# EAGLE design Ai_Breakout_OLED-0.96 (EAGLE 6.5.0)
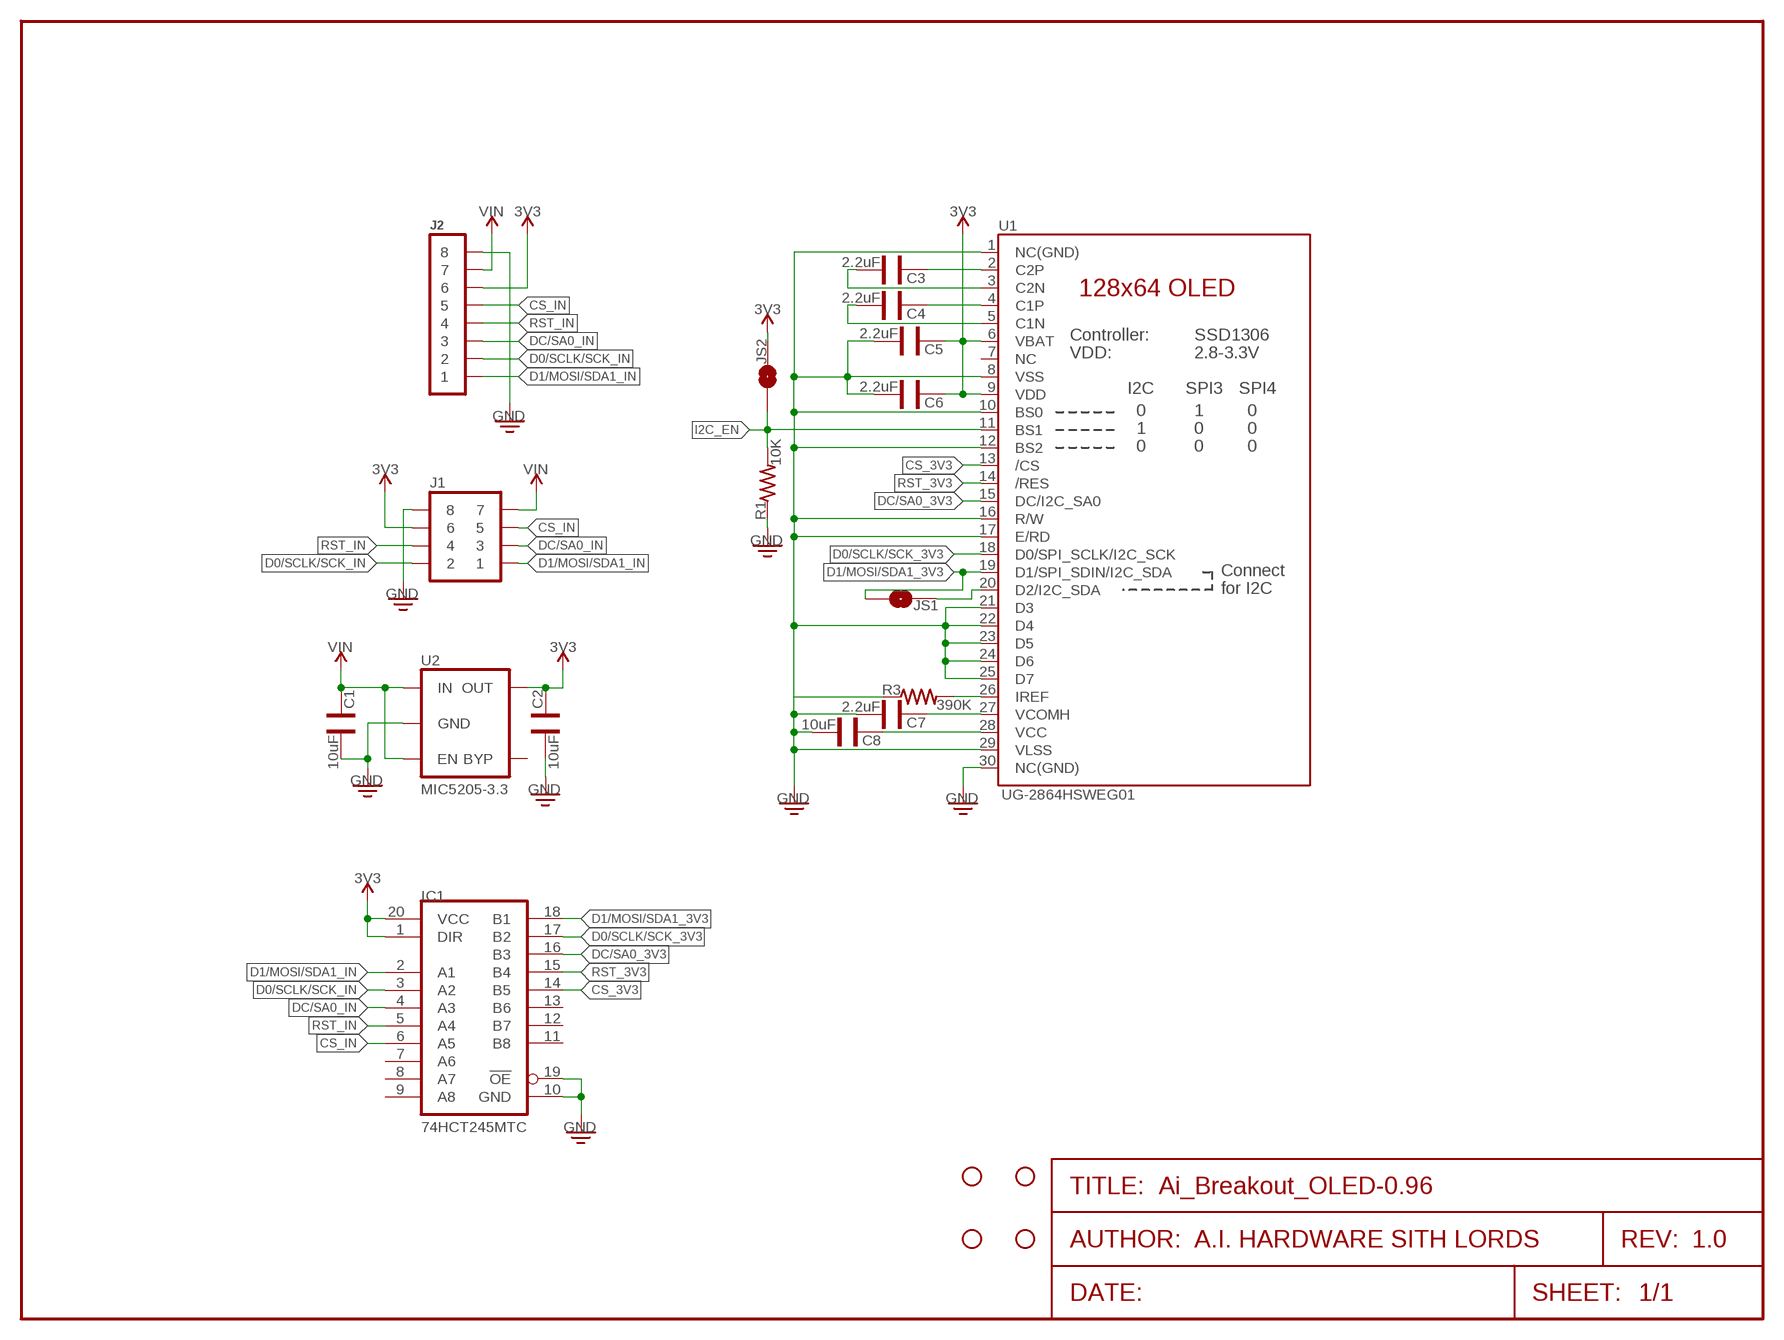
[diagram p0: schematic, sheet 1]
FRAME1 (FRAME-LETTER): AUTHOR: A.I. HARDWARE SITH LORDS; REV: 1.0

## Parts
C1  10uF  CAP0603  [CAP-0603]
C2  10uF  CAP0603  [CAP-0603]
C3  2.2uF  CAP0603  [CAP-0603]
C4  2.2uF  CAP0603  [CAP-0603]
C5  2.2uF  CAP0603  [CAP-0603]
C6  2.2uF  CAP0603  [CAP-0603]
C7  2.2uF  CAP0603  [CAP-0603]
C8  10uF  CAP0603  [CAP-0603]
IC1  74HCT245MTC  [SSOP20]
J1  2X04  [2X04]
J2  1X08  [1X08]
JS1  1X02-SJ-NO  [1X02-SJ-NO]
JS2  1X02-SJ-NO  [1X02-SJ-NO]
M1  STAND-OFF  [STAND-OFF]
M2  STAND-OFF  [STAND-OFF]
M3  STAND-OFF  [STAND-OFF]
M4  STAND-OFF  [STAND-OFF]
R1  10K  RES0603  [RES-0603]
R3  390K  RES0603  [RES-0603]
U1  UG-2864HSWEG01  UG-2864HSWEG01-0.96  [UG-2864HSWEG01_0.96_WRAP]
U2  MIC5205-3.3  [SOT23-5]

## Nets
3V3: C2.2 C5.2 C6.2 IC1.1(DIR) IC1.20(VCC) J1.6 J2.6 JS2.2 U1.6(VBAT) U1.9(VDD) U2.5(OUT)
CS_3V3: IC1.14(B5) U1.13(/CS)
CS_IN: IC1.6(A5) J1.5 J2.5
D0/SCLK/SCK_3V3: IC1.17(B2) U1.18(D0/SPI_SCLK/I2C_SCK)
D0/SCLK/SCK_IN: IC1.3(A2) J1.2 J2.2
D1/MOSI/SDA1_3V3: IC1.18(B1) JS1.1 U1.19(D1/SPI_SDIN/I2C_SDA)
D1/MOSI/SDA1_IN: IC1.2(A1) J1.1 J2.1
DC/SA0_3V3: IC1.16(B3) U1.15(DC/I2C_SA0)
DC/SA0_IN: IC1.4(A3) J1.3 J2.3
GND: C1.1 C2.1 C5.1 C6.1 C7.1 C8.1 IC1.10(GND) IC1.19(!OE) J1.8 J2.8 R1.1 R3.1 U1.1(NC(GND)) U1.8(VSS) U1.10(BS0) U1.12(BS2) U1.16(R/W) U1.17(E/RD) U1.21(D3) U1.22(D4) U1.23(D5) U1.24(D6) U1.25(D7) U1.29(VLSS) U1.30(NC(GND)) U2.2(GND)
I2C_EN: JS2.1 R1.2 U1.11(BS1)
N$3: R3.2 U1.26(IREF)
N$4: C3.2 U1.2(C2P)
N$5: C3.1 U1.3(C2N)
N$6: C4.2 U1.4(C1P)
N$7: C4.1 U1.5(C1N)
N$8: JS1.2 U1.20(D2/I2C_SDA)
N$11: C8.2 U1.28(VCC)
N$12: C7.2 U1.27(VCOMH)
RST_3V3: IC1.15(B4) U1.14(/RES)
RST_IN: IC1.5(A4) J1.4 J2.4
VIN: C1.2 J1.7 J2.7 U2.1(IN) U2.3(EN)
Unconnected: IC1.7(A6) IC1.8(A7) IC1.9(A8) IC1.11(B8) IC1.12(B7) IC1.13(B6) U1.7(NC) U2.4(BYP)

## Library data of the parts
C1-C8 = Ai_Passives:CAP
IC1 = Ai_IC:74HCT245: Octal BUS TRANSCEIVER, 3-state
J1 = Ai_Connectors:2X04
J2 = Ai_Connectors:1X08
JS1 JS2 = Ai_Connectors:1X02-SJ-NO: Solder Jumper SMD solder jumper: Normally Open and Normally Closed are the same, but have different paste layers. NC will have a large amount of paste and should jumper during reflow.
M1-M4 = Ai_Electromechanical:STAND-OFF: #4 Stand Off This is the mechanical footprint for a #4 phillips button head screw. Use the keepout ring to avoid running the screw head into surrounding components.
R1 R3 = Ai_Passives:RES: Part # blah Digikey
U1 = Ai_Displays:UG-2864HSWEG01: UG-2864HSWEG01 OLED display Both 1.3" and 0.96" models share the same FPC tab footprint, only the screen dimensions vary.
U2 = Ai_Power:MIC5205-*: Fixed-Voltage Regulator Standard voltage regulator in SOT23-5 layout. Micrel part MIC5205x.x where x.x designates the output voltage (e.g., 3.3). BYP pin is used to lower output noise with 470pF cap. Haven't tested the footprint on an actual board yet!

## Board
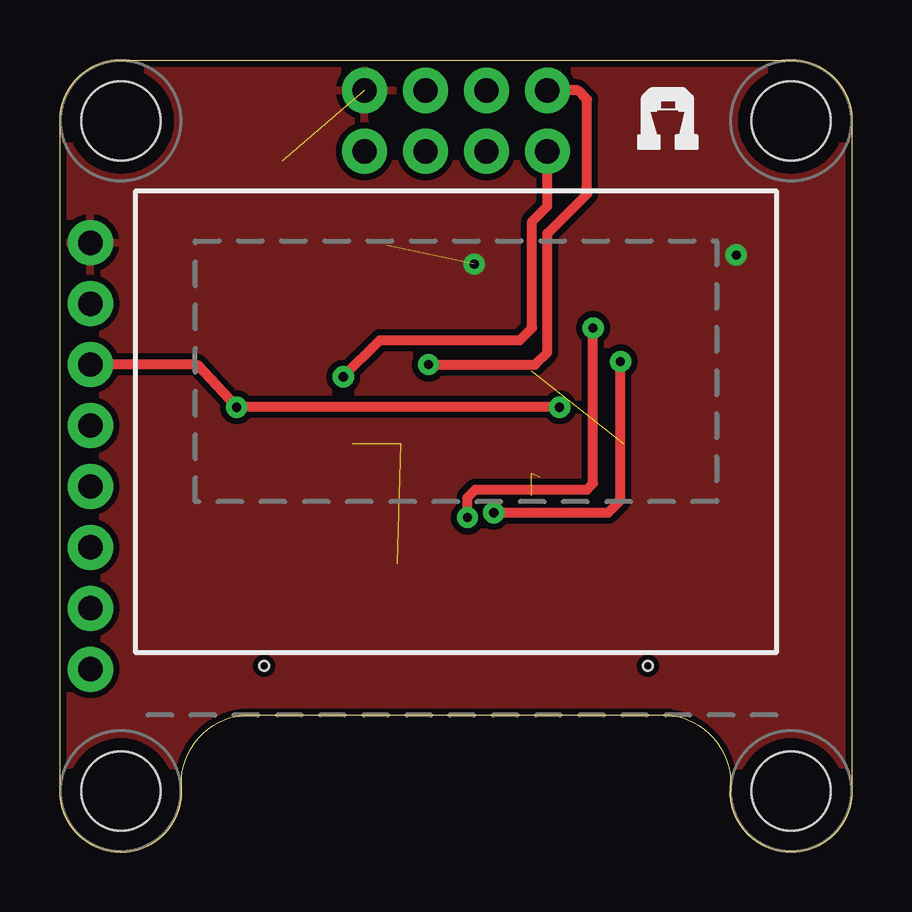
[diagram p1: board, top side]
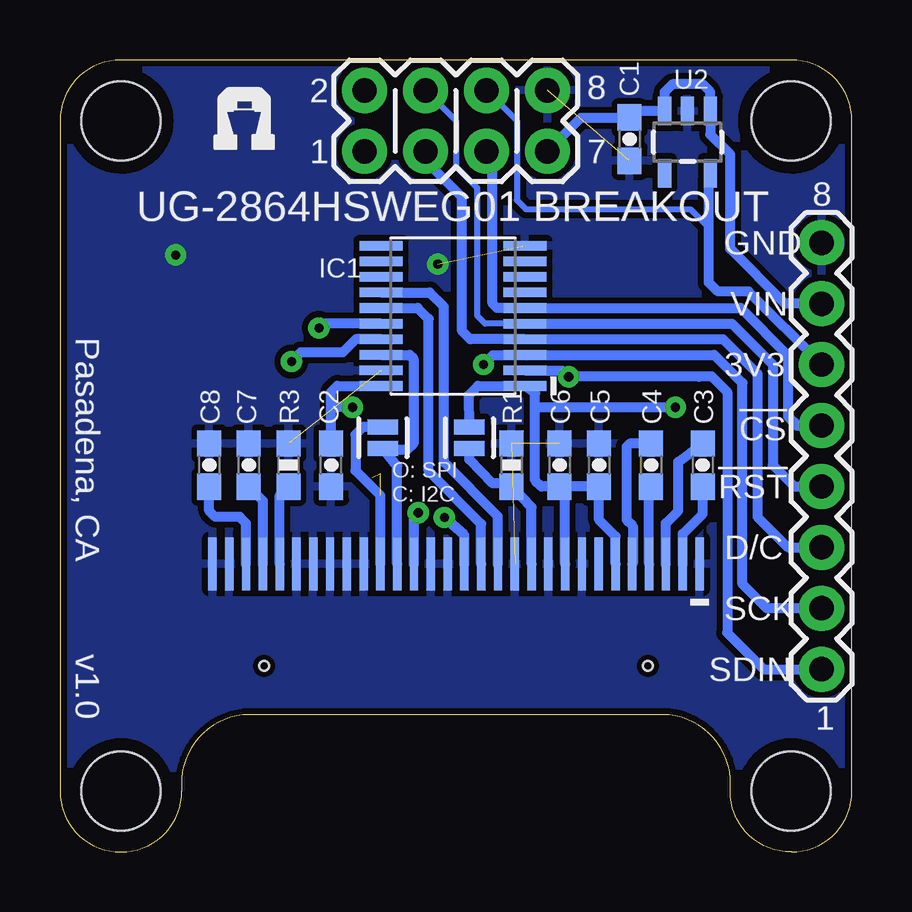
[diagram p2: board, bottom side, seen from below]

Size 33.02 x 33.02 mm. Coordinates in mm from the lower left corner, seen from the top.
Outline: 0,2.54 0,30.48 arc-90 2.54,33.02 30.48,33.02 arc-90 33.02,30.48 33.02,2.54 arc-90 30.48,0 arc-90 27.94,2.54 arc90 25.4,5.71 7.62,5.71 arc90 5.08,2.54 arc-90 2.54,0 arc-90 0,2.54
Copper layers (1*16): Top 0.035mm / dielectric 1.5mm / Bottom 0.035mm
Design rules "ai_2layer": minimum track width 7mil, minimum drill 15mil, track to track 8mil, track to pad 8mil, pad to pad 8mil, via to via 8mil, smd to smd 8mil, copper to edge 8mil, drill to drill 8mil, minimum pad ring 12mil, minimum via ring 10mil, stop-mask expansion 4mil, vias tented up to drill 20mil, thermal gap 10mil

### Footprints (pad centres in the part's own frame; a part is rotated, then mirrored left to right if it is on the bottom)
CAP-0603 = smd 1.1 x 1: 1 -0.9,0; 2 0.9,0
SSOP20 = smd 0.4 x 1.8: 1 -2.925,-3; 2 -2.275,-3; 3 -1.625,-3; 4 -0.975,-3; 5 -0.325,-3; 6 0.325,-3; 7 0.975,-3; 8 1.625,-3; 9 2.275,-3; 10 2.925,-3; 11 2.925,3; 12 2.275,3; 13 1.625,3; 14 0.975,3; 15 0.325,3; 16 -0.325,3; 17 -0.975,3; 18 -1.625,3; 19 -2.275,3; 20 -2.925,3
2X04 = drill 1.016 pad 1.88: 1 -3.81,-1.27; 2 -3.81,1.27; 3 -1.27,-1.27; 4 -1.27,1.27; 5 1.27,-1.27; 6 1.27,1.27; 7 3.81,-1.27; 8 3.81,1.27
1X08 = drill 1.016 pad 1.88: 1 -8.89,0; 2 -6.35,0; 3 -3.81,0; 4 -1.27,0; 5 1.27,0; 6 3.81,0; 7 6.35,0; 8 8.89,0
1X02-SJ-NO = smd 0.635 x 1.27: 1 -0.45,0; 2 0.45,0
STAND-OFF = hole 3.302: 0,0
RES-0603 = smd 1.1 x 1: 1 -0.9,0; 2 0.9,0
UG-2864HSWEG01_0.96_WRAP = smd 0.35 x 2.2 bottom: 1 -10.15,-1.2; 2 -9.45,-1.2; 3 -8.75,-1.2; 4 -8.05,-1.2; 5 -7.35,-1.2; 6 -6.65,-1.2; 7 -5.95,-1.2; 8 -5.25,-1.2; 9 -4.55,-1.2; 10 -3.85,-1.2; 11 -3.15,-1.2; 12 -2.45,-1.2; 13 -1.75,-1.2; 14 -1.05,-1.2; 15 -0.35,-1.2; 16 0.35,-1.2; 17 1.05,-1.2; 18 1.75,-1.2; 19 2.45,-1.2; 20 3.15,-1.2; 21 3.85,-1.2; 22 4.55,-1.2; 23 5.25,-1.2; 24 5.95,-1.2; 25 6.65,-1.2; 26 7.35,-1.2; 27 8.05,-1.2; 28 8.75,-1.2; 29 9.45,-1.2; 30 10.15,-1.2 | hole 0.4: -8,-5.45; 8,-5.45
SOT23-5 = smd 0.55 x 1.2: 1 -0.95,-1.3; 2 0,-1.3; 3 0.95,-1.3; 4 0.95,1.3; 5 -0.95,1.3

### Placement (x,y rotation side)
C1  9.27,29.72 90 bottom
C2  21.72,16.13 90 bottom
C3  6.22,16.13 270 bottom
C4  8.38,16.13 270 bottom
C5  10.54,16.13 270 bottom
C6  12.19,16.13 270 bottom
C7  25.15,16.13 270 bottom
C8  26.8,16.13 270 bottom
IC1  16.64,22.35 90 bottom
J1  16.51,30.48 0 bottom
J2  1.27,16.51 90 bottom
JS1  19.56,17.27 90 bottom
JS2  15.95,17.27 90 bottom
M1  2.54,30.48 0 top
M2  30.48,30.48 0 top
M3  2.54,2.54 0 top
M4  30.48,2.54 0 top
R1  14.2,16.13 270 bottom
R3  23.5,16.13 270 bottom
U1  16.51,13.21 0 top
U2  6.86,29.59 180 bottom
U$15  AI-LOGOXS  [AI-LOGO-XS]  24,29.21 0 top
U$16  AI-LOGOXS  [AI-LOGO-XS]  26.67,29.21 0 bottom

### Tracks (layer width: path | path; a pad name or v marks a point on that pad's centre or on a via)
3V3  (via drill 0.38)
  Top 0.406: J2.6 5.71,20.32 v7.37,18.54 v20.83,18.54
  Bottom 0.254: J1.6 13.97,30.48 13.97,27.18 13.59,26.8 6.73,26.8 5.97,26.04 | IC1.20 19.43,19.35
  Bottom 0.406: U1.9 11.96,15 C6.2 | C6.2 C5.2 10.54,13.84 9.86,13.16 U1.6 | C6.2 12.94,15.23 13.21,15.49 13.21,18.41 | 13.21,18.41 13.21,19.12 IC1.1 13.51,19.43 15.6,19.43 15.98,19.05 JS2.2 | J2.6 4.32,23.37 5.59,23.37 5.97,23.75 5.97,26.04 5.97,27.98 U2.5 | C2.2 21.72,18.41 | 21.72,18.41 21.72,19.18 21.46,19.43 19.51,19.43 IC1.20 | 13.21,18.41 13.08,18.54 v7.37,18.54 | v20.83,18.54 21.59,18.54 21.72,18.41
CS_3V3
  Bottom 0.406: U1.13 14.76,14 17.02,16.26 17.02,22.73 17.61,23.33 IC1.14
CS_IN
  Bottom 0.406: J2.5 2.29,17.78 2.67,18.16 2.67,20.7 4.64,22.68 IC1.6 14.8,22.68 14.99,22.86 14.99,28.96 J1.5
D0/SCLK/SCK_3V3  (via drill 0.38)
  Top 0.406: v18.09,14.15 22.86,14.15 23.37,14.66 v23.37,20.45
  Bottom 0.406: U1.18 18.26,14 v18.09,14.15 | IC1.17 20.68,21.38 21.23,20.83 22.99,20.83 v23.37,20.45
D0/SCLK/SCK_IN  (via drill 0.38)
  Top 0.406: v15.37,20.32 19.81,20.32 20.32,20.83 20.32,25.78 21.97,27.43 21.97,31.37 21.59,31.75 J1.2
  Bottom 0.406: J2.2 3.56,10.16 4.57,11.18 4.57,19.56 5.74,20.73 IC1.3 13.54,20.7 14.99,20.7 v15.37,20.32
D1/MOSI/SDA1_3V3
  Bottom 0.406: U1.19 18.96,16.1 JS1.1 19.49,16.76 18.54,16.76 18.29,17.02 18.29,20.57 18.44,20.73 IC1.18
D1/MOSI/SDA1_IN  (via drill 0.38)
  Top 0.406: v11.81,19.81 13.34,21.34 19.18,21.34 19.68,21.84 19.68,26.29 20.32,26.92 J1.1
  Bottom 0.406: J2.1 3.68,7.62 5.21,9.14 5.21,19.18 5.85,19.82 6.37,19.81 v11.81,19.81 12.06,20.07 13.5,20.07 IC1.2
DC/SA0_3V3  (via drill 0.38)
  Top 0.406: v16.99,13.95 16.99,14.78 17.32,15.11 21.97,15.11 22.23,15.37 v22.23,21.84
  Bottom 0.406: U1.15 16.16,13.21 v16.99,13.95 | IC1.16 22.04,22.03 v22.23,21.84
DC/SA0_IN
  Bottom 0.406: J2.3 2.67,12.7 3.94,13.97 3.94,19.94 5.38,21.38 IC1.4 15.92,21.38 16.26,21.72 16.26,27.3 17.78,28.83 J1.3
GND  (via drill 0.38)  (5 unrouted)
  other vias: 17.27,24.51 28.19,24.89
  pour Top (isolate 0.254): 0,0 0,33.02 33.02,33.02 33.02,0
  pour Bottom (isolate 0.254): 0,0 0,33.02 33.02,33.02 33.02,0
I2C_EN
  Bottom 0.406: U1.11 13.36,14.37 R1.2 14.34,15.23 14.48,15.37 14.99,15.37 15.95,16.36 JS2.1
N$3
  Bottom 0.406: U1.26 23.86,14.86 R3.2
N$4
  Bottom 0.406: U1.2 7.06,13.26 6.22,14.1 C3.2
N$5
  Bottom 0.406: U1.3 7.76,13.7 7.24,14.22 7.24,16.27 C3.1
N$6
  Bottom 0.406: U1.4 8.46,15.15 C4.2
N$7
  Bottom 0.406: C4.1 9.26,17.03 9.4,16.89 9.4,13.84 9.14,13.59 9.14,12.02 U1.5
N$8  (2 unrouted)
  Bottom 0.406: U1.20 19.66,14.86 20.7,15.9 20.7,17.4 20.38,17.72 JS1.2
N$11
  Bottom 0.406: U1.28 25.26,13.7 25.53,13.97 26.54,13.97 26.8,14.22 C8.2
N$12
  Bottom 0.406: U1.27 24.56,14.64 C7.2
RST_3V3
  Bottom 0.406: U1.14 15.46,13.68 17.65,15.88 17.65,22.23 18.11,22.68 IC1.15
RST_IN
  Bottom 0.254: IC1.5 15.3,22.03 15.62,22.35 15.62,27.69 16.51,28.57 16.51,30.48 J1.4
  Bottom 0.406: IC1.5 5.01,22.03 3.3,20.32 3.3,16.13 2.41,15.24 J2.4
VIN
  Bottom 0.406: J2.7 2.79,22.86 5.08,25.15 5.08,29.08 5.91,29.91 U2.1 5.91,31.69 6.22,32 7.49,32 7.81,31.69 U2.3 9.38,30.89 C1.2 9.66,30.61 11.3,30.61 J1.7

### Text on the board
bPlace: 8 | 2 | 7 | 1 | 8 | UG-2864HSWEG01 BREAKOUT | GND | VIN | Pasadena, CA | 3V3 | !CS | O: SPI / C: I2C | !RST | D/C | SCK | v1.0 | SDIN | 1